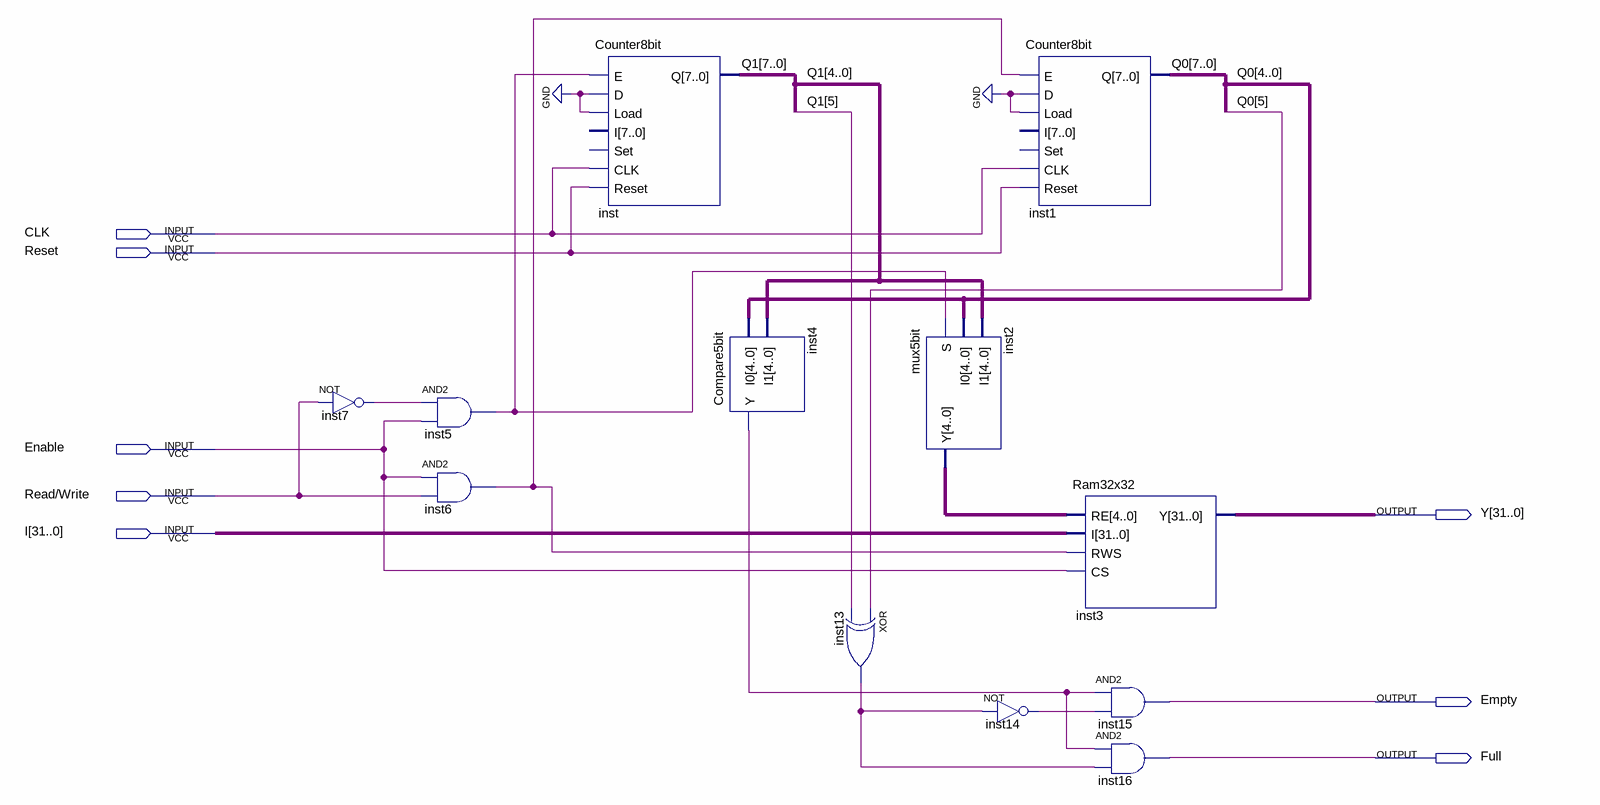
[diagram p0: schematic sheet]
// Quartus schematic QUEUE.bdf as structural Verilog: 12 symbols, 8 pins
module QUEUE (
  input  CLK,
  input  Reset,
  input  Enable,
  input  \Read/Write ,
  input  [31:0] I,
  output [31:0] Y,
  output Empty,
  output Full
);

  wire inst4_y, inst5_out, inst6_out, inst7_out, inst13_out, inst14_out;
  wire [4:0] inst2_y;
  wire [7:0] Q0, Q1;

  not inst7 (inst7_out, \Read/Write );
  and inst5 (inst5_out, inst7_out, Enable);
  and inst6 (inst6_out, Enable, \Read/Write );
  Counter8bit inst (.E(inst5_out), .D(1'b0), .Load(1'b0), .CLK(CLK), .Reset(Reset), .Q(Q1));  // open: I, Set
  Compare5bit inst4 (.I0(Q0[4:0]), .I1(Q1[4:0]), .Y(inst4_y));
  xor inst13 (inst13_out, Q0[5], Q1[5]);
  mux5bit inst2 (.S(inst5_out), .I0(Q0[4:0]), .I1(Q1[4:0]), .Y(inst2_y));
  Counter8bit inst1 (.E(inst6_out), .D(1'b0), .Load(1'b0), .CLK(CLK), .Reset(Reset), .Q(Q0));  // open: I, Set
  not inst14 (inst14_out, inst13_out);
  Ram32x32 inst3 (.RE(inst2_y), .I(I), .RWS(inst6_out), .CS(Enable), .Y(Y));
  and inst15 (Empty, inst4_y, inst14_out);
  and inst16 (Full, inst4_y, inst13_out);
endmodule
